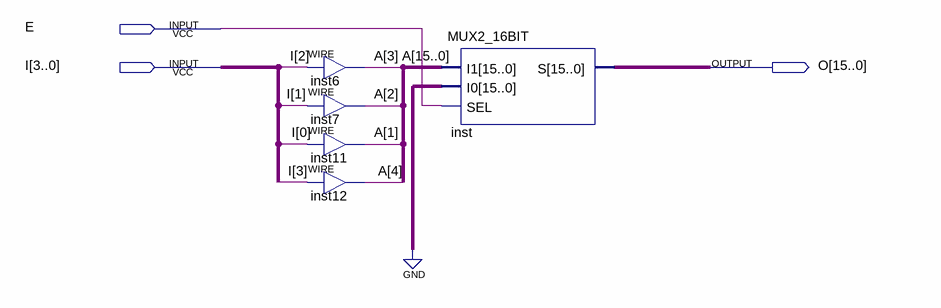
[diagram p0: schematic sheet]
// Quartus schematic SHIFT_1.bdf as structural Verilog: 5 symbols, 3 pins
module SHIFT_1 (
  input  E,
  input  [3:0] I,
  output [15:0] O
);

  wire [15:0] A;

  assign A[3] = I[2];  // WIRE inst6
  assign A[2] = I[1];  // WIRE inst7
  assign A[1] = I[0];  // WIRE inst11
  assign A[4] = I[3];  // WIRE inst12
  MUX2_16BIT inst (.I1(A), .I0({16{1'b0}}), .SEL(E), .S(O));
endmodule
